# EAGLE schematic merged (EAGLE 7.4.0)
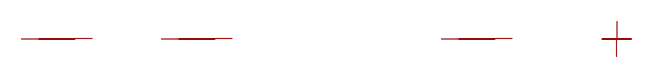
[diagram p0: schematic, sheet 1]

## Parts
C1_B  100n  C-EU025-025X050  [C_RADIAL]
R1  10k  R-EU_0207/10  [R_AXIAL]
R1_B  1k  R-EU_0207/10  [R_AXIAL]
R2  4.7k  R-EU_0207/10  [R_AXIAL]
Unconnected: C1_B.1 C1_B.2 R1.1 R1.2 R1_B.1 R1_B.2 R2.1 R2.2

## Library data of the parts
C1_B = rcl:C-EU
R1 R1_B R2 = rcl:R-EU_